# Altium project a20.PrjPcb
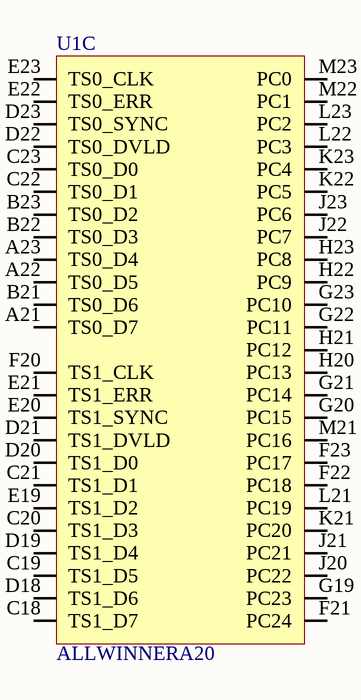
[diagram p0: 01.SchDoc]
8 sheets, 169 parts. Net scope: global (net labels, ports and power ports of the same name join across sheets).
Sheets:
  01.SchDoc
  [02]Power.SchDoc
  [01]DDR3.SchDoc
  [03]SDCard.SchDoc
  [04]USB.SchDoc
  [05]Ethernet.SchDoc
  [06]CPU-PWR.SchDoc
  [07]CPU-Periph.SchDoc

## Sheet 01.SchDoc
size A4

### Parts
U1  MPN: ALLWINNERA20  [A20]  (hidden comment: Allwinner A20 SOC)  (part C of 5)

### Nets

Not connected (* = marked no-connect by the designer): U1 A21(TS0_D7) A22(TS0_D5) A23(TS0_D4) B21(TS0_D6) B22(TS0_D3) B23(TS0_D2) C18(TS1_D7) C19(TS1_D5) C20(TS1_D3) C21(TS1_D1) C22(TS0_D1) C23(TS0_D0) D18(TS1_D6) D19(TS1_D4) D20(TS1_D0) D21(TS1_DVLD) D22(TS0_DVLD) D23(TS0_SYNC) E19(TS1_D2) E20(TS1_SYNC) E21(TS1_ERR) E22(TS0_ERR) E23(TS0_CLK) F20(TS1_CLK) F21(PC24) F22(PC18) F23(PC17) G19(PC23) G20(PC15) G21(PC14) G22(PC11) G23(PC10) H20(PC13) H21(PC12) H22(PC9) H23(PC8) J20(PC22) J21(PC21) J22(PC7) J23(PC6) K21(PC20) K22(PC5) K23(PC4) L21(PC19) L22(PC3) L23(PC2) M21(PC16) M22(PC1) M23(PC0)

### Library data of the parts
U1 = ALLWINNER-A20

## Sheet [02]Power.SchDoc
size A3
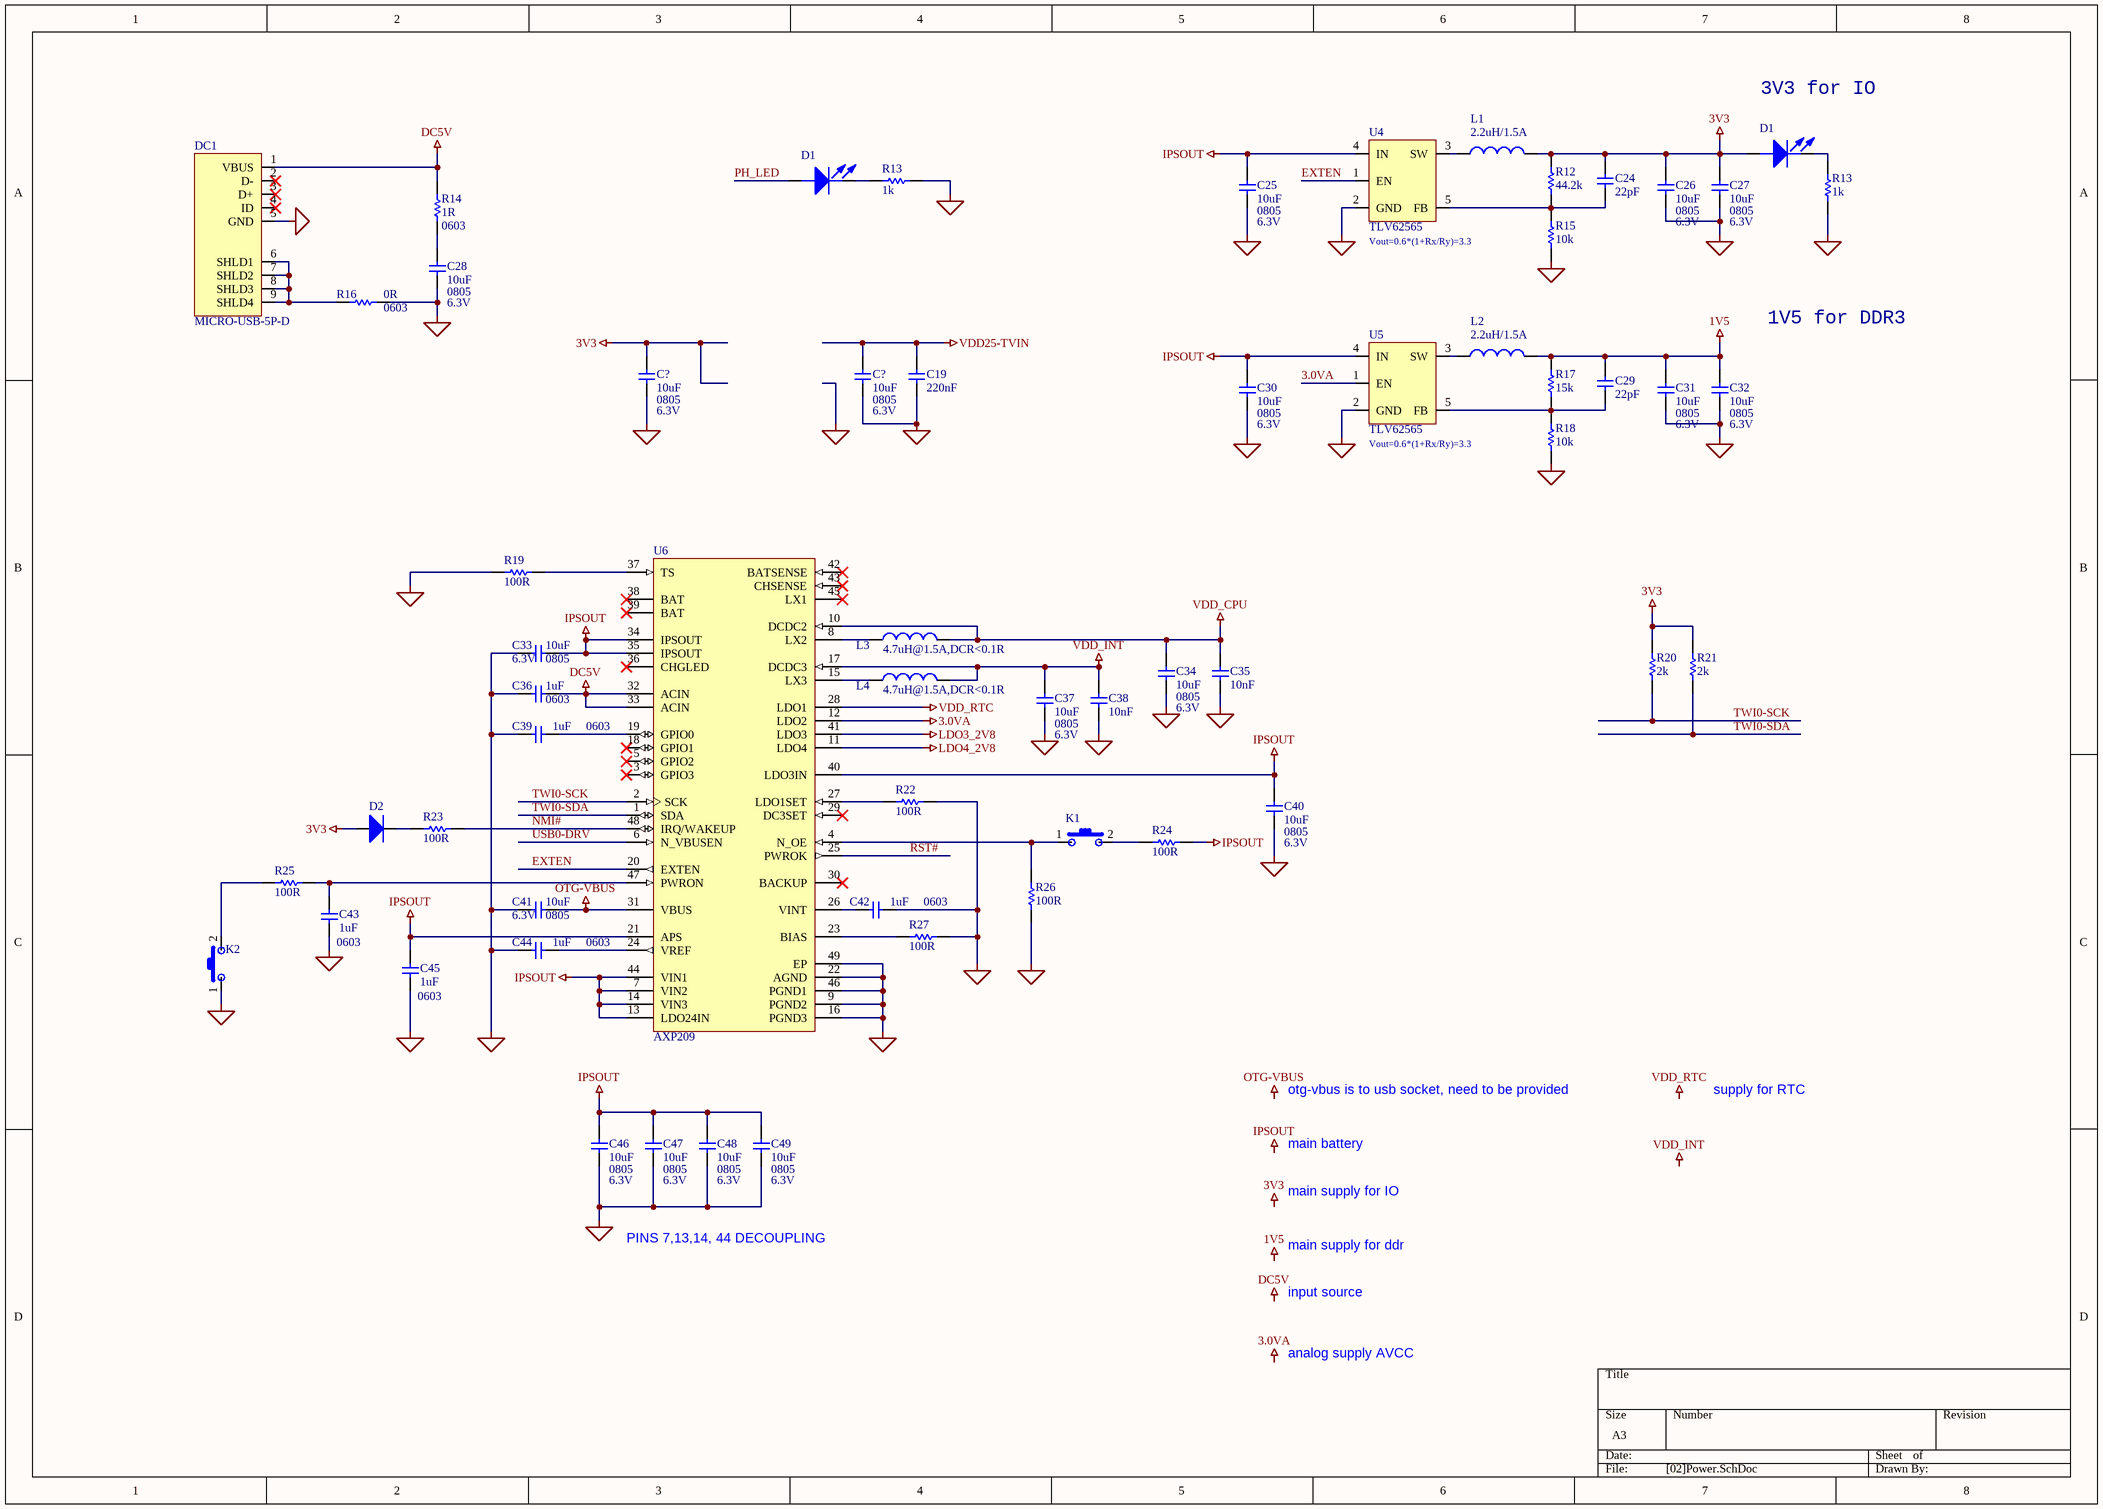
[diagram p1: [02]Power.SchDoc]

### Parts
(Parts that share a designator on the sheet are numbered #1, #2 ... from top to bottom, then left to right.)
C19#1  value 220nF  [C0402]  (hidden comment: SMD Capacitor Chip)
C24  value 22pF  [C0402]  (hidden comment: SMD Capacitor Chip)
C25  value 10uF  Voltage: 6.3V  Package / Case: 0805  [C0805]  (hidden comment: SMD Capacitor Chip)
C26  value 10uF  Voltage: 6.3V  Package / Case: 0805  [C0805]  (hidden comment: SMD Capacitor Chip)
C27  value 10uF  Voltage: 6.3V  Package / Case: 0805  [C0805]  (hidden comment: SMD Capacitor Chip)
C28  value 10uF  Voltage: 6.3V  Package / Case: 0805  [C0805]  (hidden comment: SMD Capacitor Chip)
C29  value 22pF  [C0402]  (hidden comment: SMD Capacitor Chip)
C30  value 10uF  Voltage: 6.3V  Package / Case: 0805  [C0805]  (hidden comment: SMD Capacitor Chip)
C31  value 10uF  Voltage: 6.3V  Package / Case: 0805  [C0805]  (hidden comment: SMD Capacitor Chip)
C32  value 10uF  Voltage: 6.3V  Package / Case: 0805  [C0805]  (hidden comment: SMD Capacitor Chip)
C33  value 10uF  Voltage: 6.3V  Package / Case: 0805  [C0805]  (hidden comment: SMD Capacitor Chip)
C34  value 10uF  Voltage: 6.3V  Package / Case: 0805  [C0805]  (hidden comment: SMD Capacitor Chip)
C35  value 10nF  [C0402]  (hidden comment: SMD Capacitor Chip)
C36  value 1uF  Package / Case: 0603  [C0603]  (hidden comment: SMD Capacitor Chip)
C37  value 10uF  Voltage: 6.3V  Package / Case: 0805  [C0805]  (hidden comment: SMD Capacitor Chip)
C38  value 10nF  [C0402]  (hidden comment: SMD Capacitor Chip)
C39  value 1uF  Package / Case: 0603  [C0603]  (hidden comment: SMD Capacitor Chip)
C40  value 10uF  Voltage: 6.3V  Package / Case: 0805  [C0805]  (hidden comment: SMD Capacitor Chip)
C41  value 10uF  Voltage: 6.3V  Package / Case: 0805  [C0805]  (hidden comment: SMD Capacitor Chip)
C42  value 1uF  Package / Case: 0603  [C0603]  (hidden comment: SMD Capacitor Chip)
C43  value 1uF  Package / Case: 0603  [C0603]  (hidden comment: SMD Capacitor Chip)
C44  value 1uF  Package / Case: 0603  [C0603]  (hidden comment: SMD Capacitor Chip)
C45  value 1uF  Package / Case: 0603  [C0603]  (hidden comment: SMD Capacitor Chip)
C46  value 10uF  Voltage: 6.3V  Package / Case: 0805  [C0805]  (hidden comment: SMD Capacitor Chip)
C47  value 10uF  Voltage: 6.3V  Package / Case: 0805  [C0805]  (hidden comment: SMD Capacitor Chip)
C48  value 10uF  Voltage: 6.3V  Package / Case: 0805  [C0805]  (hidden comment: SMD Capacitor Chip)
C49  value 10uF  Voltage: 6.3V  Package / Case: 0805  [C0805]  (hidden comment: SMD Capacitor Chip)
C?#1  value 10uF  Voltage: 6.3V  Package / Case: 0805  [C0805]  (hidden comment: SMD Capacitor Chip)
C?#2  value 10uF  Voltage: 6.3V  Package / Case: 0805  [C0805]  (hidden comment: SMD Capacitor Chip)
D1#1  SMD Led Diode  (value not drawn)
D1#2  SMD Led Diode  (value not drawn)
D2  Diode SMD Chip  (value not drawn)
DC1  MPN: MICRO-USB-5P-D  (hidden comment: SMD USB Jack)
K1  SMD Tact Switch  (value not drawn)
K2  SMD Tact Switch  (value not drawn)
L1  value 2.2uH/1.5A  (hidden comment: SMD Coil Chip)
L2  value 2.2uH/1.5A  (hidden comment: SMD Coil Chip)
L3  value 4.7uH@1.5A,DCR<0.1R  (hidden comment: SMD Coil Chip)
L4  value 4.7uH@1.5A,DCR<0.1R  (hidden comment: SMD Coil Chip)
R12  value 44.2k  (hidden comment: SMD Resistor Chip)
R13#1  value 1k  (hidden comment: SMD Resistor Chip)
R13#2  value 1k  (hidden comment: SMD Resistor Chip)
R14  value 1R  Package / Case: 0603  (hidden comment: SMD Resistor Chip)
R15  value 10k  (hidden comment: SMD Resistor Chip)
R16  value 0R  Package / Case: 0603  (hidden comment: SMD Resistor Chip)
R17  value 15k  (hidden comment: SMD Resistor Chip)
R18  value 10k  (hidden comment: SMD Resistor Chip)
R19  value 100R  (hidden comment: SMD Resistor Chip)
R20  value 2k  (hidden comment: SMD Resistor Chip)
R21  value 2k  (hidden comment: SMD Resistor Chip)
R22  value 100R  (hidden comment: SMD Resistor Chip)
R23  value 100R  (hidden comment: SMD Resistor Chip)
R24  value 100R  (hidden comment: SMD Resistor Chip)
R25  value 100R  (hidden comment: SMD Resistor Chip)
R26  value 100R  (hidden comment: SMD Resistor Chip)
R27  value 100R  (hidden comment: SMD Resistor Chip)
U4  MPN: TLV62565  (hidden comment: SMD Step-Down Converter)
U5  MPN: TLV62565  (hidden comment: SMD Step-Down Converter)
U6  AXP209  [XPWR-QFN48-4100X4100TP_N]

### Nets
1V5: C29.1 C31.1 C32.1 L2.2 R17.2
3.0VA: U5.1(EN) U6.12(LDO2)
3V3: C24.1 C26.1 C27.1 C?#1.1 D1#1.1 D2.1(A) L1.2 R12.2 R20.2 R21.2
DC5V: C36.1 DC1.1(VBUS) R14.2 U6.32(ACIN) U6.33(ACIN)
IPSOUT: C25.1 C30.1 C33.1 C40.1 C45.2 C46.1 C47.1 C48.1 C49.1 R24.1 U4.4(IN) U5.4(IN) U6.7(VIN2) U6.13(LDO24IN) U6.14(VIN3) U6.21(APS) U6.34(IPSOUT) U6.35(IPSOUT) U6.40(LDO3IN) U6.44(VIN1)
LDO3_2V8: U6.41(LDO3)
LDO4_2V8: U6.11(LDO4)
OTG-VBUS: C41.1 U6.31(VBUS)
SGND: C19#1.1 C25.2 C26.2 C27.2 C28.2 C30.2 C31.2 C32.2 C33.2 C34.2 C35.1 C36.2 C37.2 C38.1 C39.2 C40.2 C41.2 C42.1 C43.1 C44.2 C45.1 C46.2 C47.2 C48.2 C49.2 C?#1.2 C?#2.2 DC1.5(GND) K2.1 R13#1.1 R13#2.1 R15.1 R16.1 R18.1 R19.1 R22.1 R26.1 R27.2 U4.2(GND) U5.2(GND) U6.9(PGND2) U6.16(PGND3) U6.22(AGND) U6.46(PGND1) U6.49(EP)
VDD25-TVIN: C19#1.2 C?#2.1
VDD_CPU: C34.1 C35.2 L3.2 U6.10(DCDC2)
VDD_INT: C37.1 C38.2 L4.2 U6.17(DCDC3)
VDD_RTC: U6.28(LDO1)
EXTEN: U4.1(EN) U6.20(EXTEN)
NMI#: R23.2 U6.48(IRQ/WAKEUP)
PH_LED: D1#2.1
RST#: U6.25(PWROK)
TWI0-SCK: R20.1 U6.2(SCK)
TWI0-SDA: R21.1 U6.1(SDA)
USB0-DRV: U6.6(N_VBUSEN)
NetC24_2: C24.2 R12.1 R15.2 U4.5(FB)
NetC28_1: C28.1 R14.1
NetC29_2: C29.2 R17.1 R18.2 U5.5(FB)
NetC39_1: C39.1 U6.19(GPIO0)
NetC42_2: C42.2 U6.26(VINT)
NetC43_2: C43.2 R25.2 U6.47(PWRON)
NetC44_1: C44.1 U6.24(VREF)
NetD1#1_2: D1#1.2 R13#2.2
NetD1#2_2: D1#2.2 R13#1.2
NetD2_2: D2.2(K) R23.1
NetDC1_6: DC1.6(SHLD1) DC1.7(SHLD2) DC1.8(SHLD3) DC1.9(SHLD4) R16.2
NetK1_1: K1.1 R26.2 U6.4(N_OE)
NetK1_2: K1.2 R24.2
NetK2_2: K2.2 R25.1
NetL1_1: L1.1 U4.3(SW)
NetL2_1: L2.1 U5.3(SW)
NetL3_1: L3.1 U6.8(LX2)
NetL4_1: L4.1 U6.15(LX3)
NetR19_2: R19.2 U6.37(TS)
NetR22_2: R22.2 U6.27(LDO1SET)
NetR27_1: R27.1 U6.23(BIAS)

Not connected (* = marked no-connect by the designer): DC1 2(D-)* 3(D+)* 4(ID)*; U6 3(GPIO3)* 5(GPIO2)* 18(GPIO1)* 29(DC3SET)* 30(BACKUP)* 36(CHGLED)* 38(BAT)* 39(BAT)* 42(BATSENSE)* 43(CHSENSE)* 45(LX1)*

### Notes on the sheet
- 3V3 for IO
- (near U4) Vout=0.6*(1+Rx/Ry)=3.3
- 1V5 for DDR3
- (near U5) Vout=0.6*(1+Rx/Ry)=3.3
- otg-vbus is to usb socket, need to be provided
- supply for RTC
- main battery
- PINS 7,13,14, 44 DECOUPLING
- main supply for IO
- main supply for ddr
- input source
- analog supply AVCC
- Labels drawn without touching a wire or pin: 1V5, 3.0VA, 3V3, DC5V, IPSOUT, OTG-VBUS, VDD_INT, VDD_RTC

### Library data of the parts
C19#1 C24 C29 C35 C38 = CAP: SMD Capacitor; Tolerance: 20%; Voltage: 50V; MPN: ?; Package / Case: 0402
C25-C28 C30-C34 C37 C40 C41 C46-C49 C?#1 C?#2 = CAP: SMD Capacitor; Tolerance: 20%; MPN: ?
C36 C39 C42-C45 = CAP: SMD Capacitor; Tolerance: 20%; Voltage: 16V; MPN: ?
D1#1 D1#2 = LED: SMD Led Diode Chip; MPN: ?; Package / Case: LED0805; Manufacturer: ?
D2 = DIODE: SMD Diode; MPN: ?; Value: ?; Voltage: ?
DC1 = USB-JACK: SMD USB DC Jack
K1 K2 = BUTTON: MPN: ?
L1-L4 = COIL: SMD Coil; Current Rating: 1A; Inductance: 4.7uH; MPN: ?; Series Resistance: ?
R12 R13#1 R13#2 R14-R27 = RES: SMD Resistor; Tolerance: 1%; MPN: ?
  R12 R13#1 R13#2 R15 R17 R18: Package / Case: 0603
  R19-R27: Package / Case: 0402
U4 U5 = TLV6256x: TLV6256x 1.5-A High Efficiency Step-Down Converters in SOT-23 5-Pin Package; Manufacturer: Texas Instruments
U6 = CMP-0571-00001-2: Enhanced Single Cell Li-Battery and Power System Management IC, 2 Channel Buck DC-DC Converter, 5 Channel LDO, 12-Bit ADC, 4 Channel GPIO, -40 to 130 degC, 48-Pin QFN; Manufacturer: X-Powers; Iout: 2500 mA; ACIN Under Voltage Locout: 3.8 V; Oscillator Frequency: 1.5 MHz; Charge Current: 1200 mA; ACIN Input Voltage: 3.8 to 6.3 V; ComponentLink2URL: http://www.x-powers.com/download/AXP209%20Datasheet%20v1.0_cn.pdf; ComponentLink1URL: http://www.x-powers.com/; PackageDescription: 48-Pin Quad Flat No-Lead Package, Body 6 x 6 mm, Pitch 0.4 mm; Operating Temperature Range: -40 to 130 degC; PackageReference: QFN-48; ComponentLink1Description: Manufacturer URL; PartNumber: AXP209; DatasheetVersion: V1.0; Mounting Technology: Surface Mount; ComponentLink2Description: Datasheet

## Sheet [01]DDR3.SchDoc
size A3
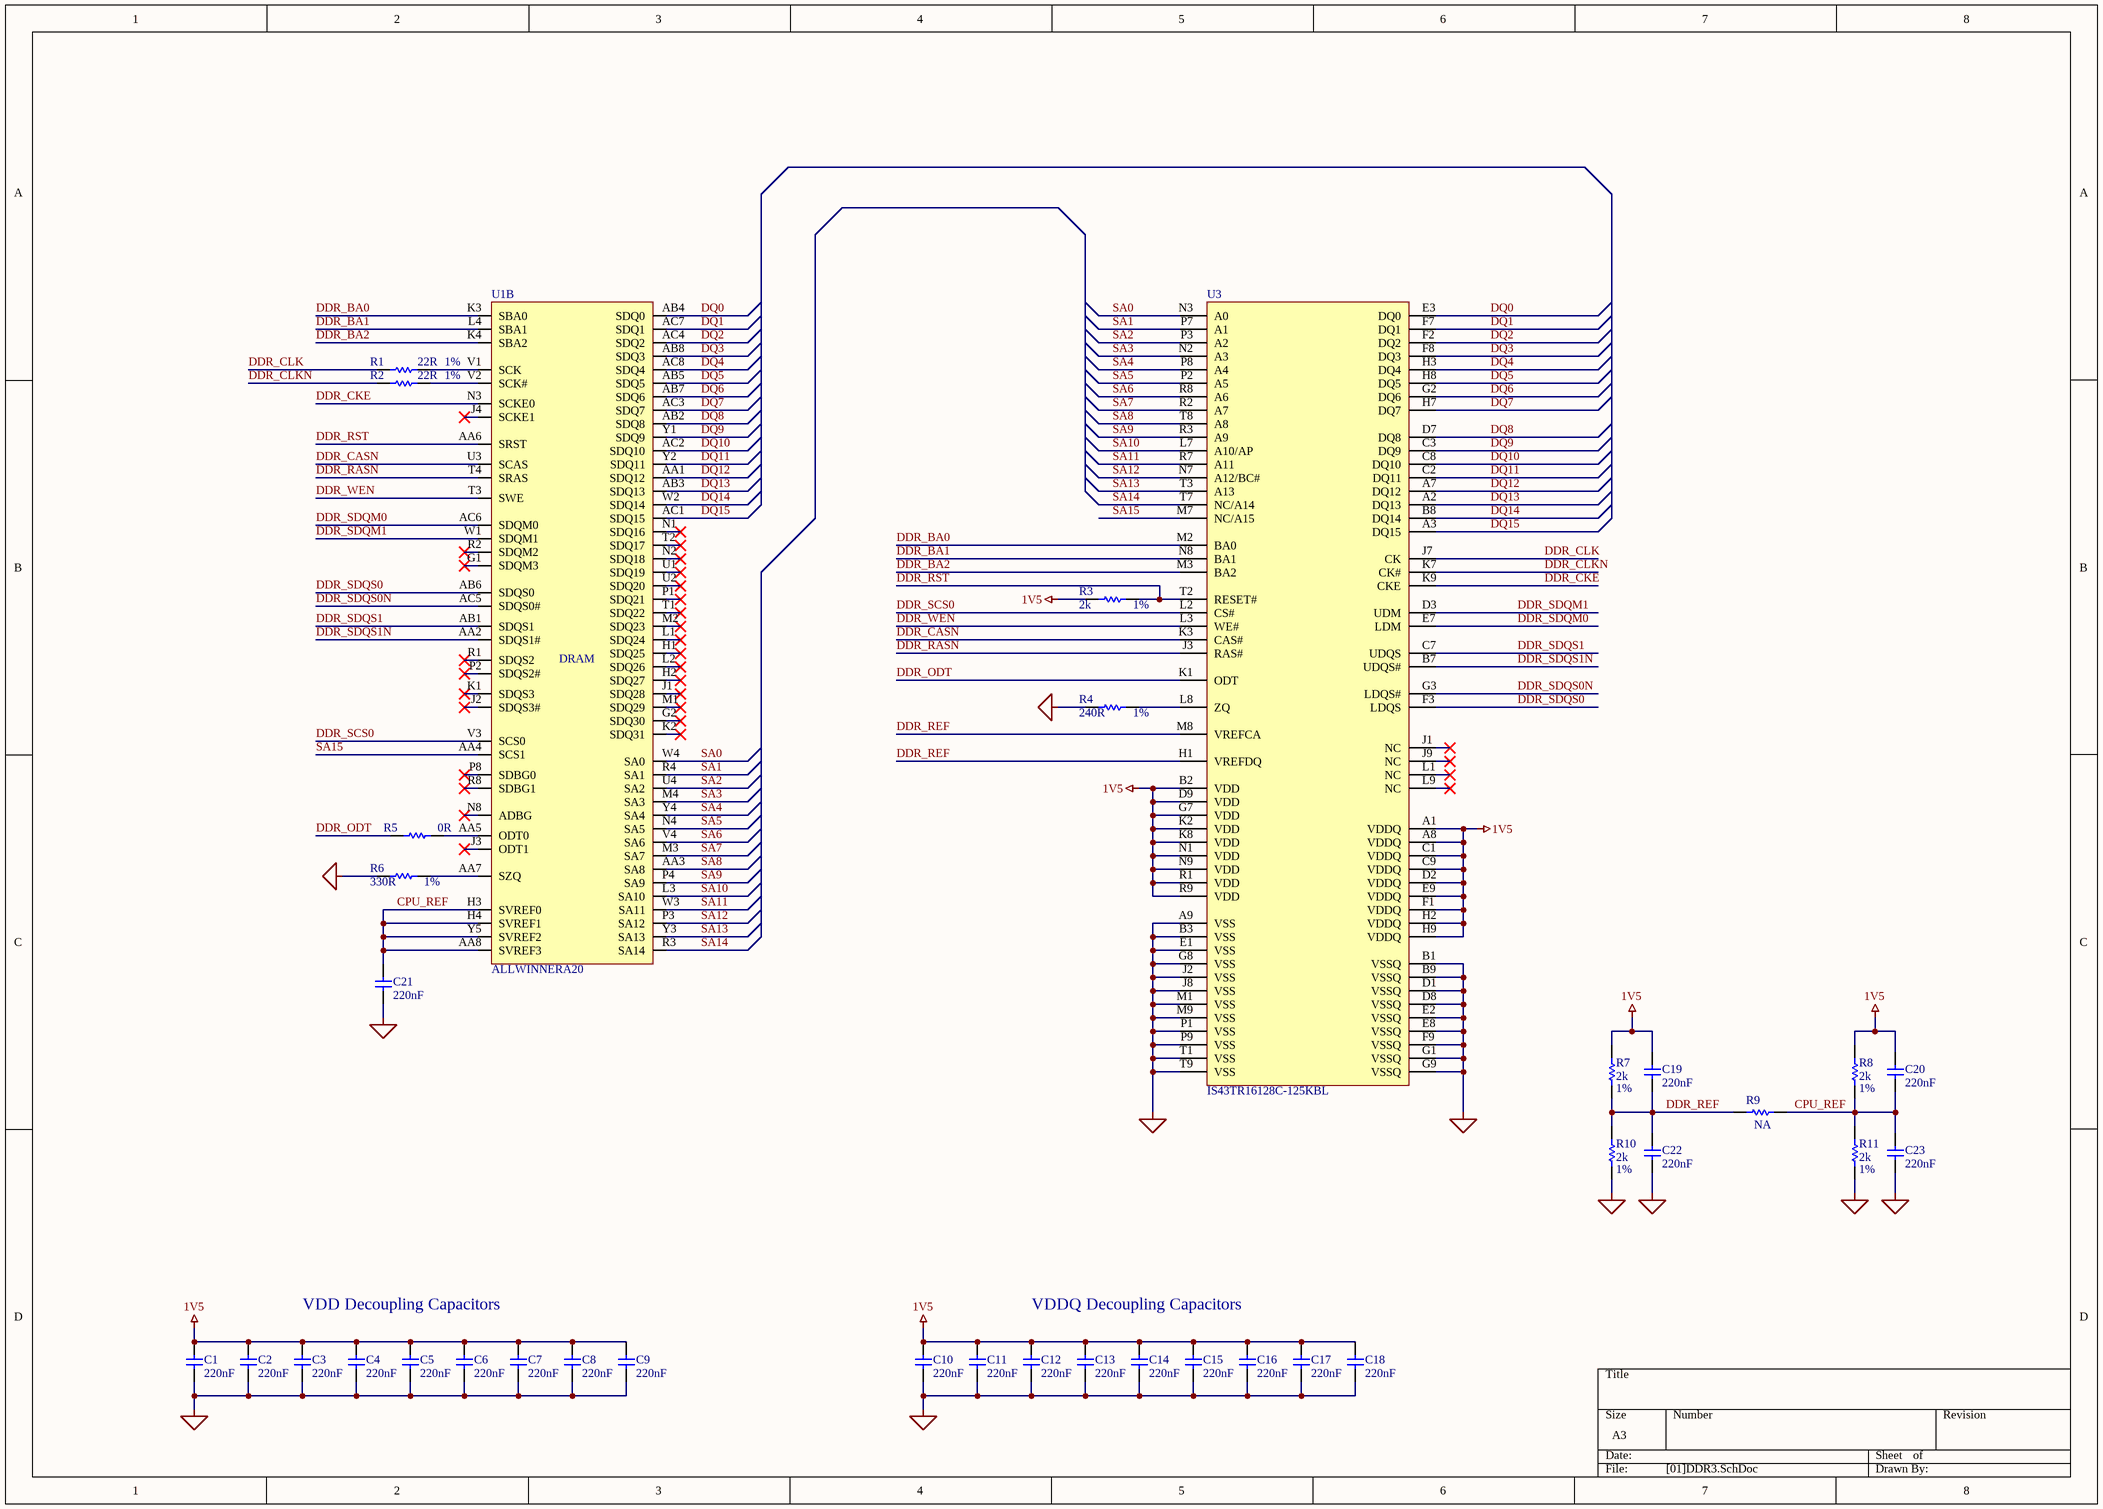
[diagram p2: [01]DDR3.SchDoc]

### Parts
(Parts that share a designator on the sheet are numbered #1, #2 ... from top to bottom, then left to right.)
C1  value 220nF  [C0402]  (hidden comment: SMD Capacitor Chip)
C2  value 220nF  [C0402]  (hidden comment: SMD Capacitor Chip)
C3  value 220nF  [C0402]  (hidden comment: SMD Capacitor Chip)
C4  value 220nF  [C0402]  (hidden comment: SMD Capacitor Chip)
C5  value 220nF  [C0402]  (hidden comment: SMD Capacitor Chip)
C6  value 220nF  [C0402]  (hidden comment: SMD Capacitor Chip)
C7  value 220nF  [C0402]  (hidden comment: SMD Capacitor Chip)
C8  value 220nF  [C0402]  (hidden comment: SMD Capacitor Chip)
C9  value 220nF  [C0402]  (hidden comment: SMD Capacitor Chip)
C10  value 220nF  [C0402]  (hidden comment: SMD Capacitor Chip)
C11  value 220nF  [C0402]  (hidden comment: SMD Capacitor Chip)
C12  value 220nF  [C0402]  (hidden comment: SMD Capacitor Chip)
C13  value 220nF  [C0402]  (hidden comment: SMD Capacitor Chip)
C14  value 220nF  [C0402]  (hidden comment: SMD Capacitor Chip)
C15  value 220nF  [C0402]  (hidden comment: SMD Capacitor Chip)
C16  value 220nF  [C0402]  (hidden comment: SMD Capacitor Chip)
C17  value 220nF  [C0402]  (hidden comment: SMD Capacitor Chip)
C18  value 220nF  [C0402]  (hidden comment: SMD Capacitor Chip)
C19#2  value 220nF  [C0402]  (hidden comment: SMD Capacitor Chip)
C20  value 220nF  [C0402]  (hidden comment: SMD Capacitor Chip)
C21  value 220nF  [C0402]  (hidden comment: SMD Capacitor Chip)
C22  value 220nF  [C0402]  (hidden comment: SMD Capacitor Chip)
C23  value 220nF  [C0402]  (hidden comment: SMD Capacitor Chip)
R1  value 22R  Tolerance: 1%  (hidden comment: SMD Resistor Chip)
R2  value 22R  Tolerance: 1%  (hidden comment: SMD Resistor Chip)
R3  value 2k  Tolerance: 1%  (hidden comment: SMD Resistor Chip)
R4  value 240R  Tolerance: 1%  (hidden comment: SMD Resistor Chip)
R5  value 0R  (hidden comment: SMD Resistor Chip)
R6  value 330R  Tolerance: 1%  (hidden comment: SMD Resistor Chip)
R7  value 2k  Tolerance: 1%  (hidden comment: SMD Resistor Chip)
R8  value 2k  Tolerance: 1%  (hidden comment: SMD Resistor Chip)
R9  value NA  (hidden comment: SMD Resistor Chip)
R10  value 2k  Tolerance: 1%  (hidden comment: SMD Resistor Chip)
R11  value 2k  Tolerance: 1%  (hidden comment: SMD Resistor Chip)
U1  MPN: ALLWINNERA20  [A20]  (hidden comment: Allwinner A20 SOC)  (part B of 5)
U3  MPN: IS43TR16128C-125KBL  [BGA96L]  (hidden comment: DDR3 SDRAM)

### Nets
1V5: C1.2 C2.2 C3.2 C4.2 C5.2 C6.2 C7.2 C8.2 C9.2 C10.2 C11.2 C12.2 C13.2 C14.2 C15.2 C16.2 C17.2 C18.2 C19#2.2 C20.2 R3.1 R7.1 R8.1 U3.A1(VDDQ) U3.A8(VDDQ) U3.B2(VDD) U3.C1(VDDQ) U3.C9(VDDQ) U3.D2(VDDQ) U3.D9(VDD) U3.E9(VDDQ) U3.F1(VDDQ) U3.G7(VDD) U3.H2(VDDQ) U3.H9(VDDQ) U3.K2(VDD) U3.K8(VDD) U3.N1(VDD) U3.N9(VDD) U3.R1(VDD) U3.R9(VDD)
SGND: C1.1 C2.1 C3.1 C4.1 C5.1 C6.1 C7.1 C8.1 C9.1 C10.1 C11.1 C12.1 C13.1 C14.1 C15.1 C16.1 C17.1 C18.1 C21.1 C22.1 C23.1 R4.1 R6.1 R10.2 R11.2 U3.A9(VSS) U3.B1(VSSQ) U3.B3(VSS) U3.B9(VSSQ) U3.D1(VSSQ) U3.D8(VSSQ) U3.E1(VSS) U3.E2(VSSQ) U3.E8(VSSQ) U3.F9(VSSQ) U3.G1(VSSQ) U3.G8(VSS) U3.G9(VSSQ) U3.J2(VSS) U3.J8(VSS) U3.M1(VSS) U3.M9(VSS) U3.P1(VSS) U3.P9(VSS) U3.T1(VSS) U3.T9(VSS)
CPU_REF: C20.1 C21.2 C23.2 R8.2 R9.2 R11.1 U1.AA8(SVREF3) U1.H3(SVREF0) U1.H4(SVREF1) U1.Y5(SVREF2)
DDR_BA0: U1.K3(SBA0) U3.M2(BA0)
DDR_BA1: U1.L4(SBA1) U3.N8(BA1)
DDR_BA2: U1.K4(SBA2) U3.M3(BA2)
DDR_CASN: U1.U3(SCAS) U3.K3(CAS#)
DDR_CKE: U1.N3(SCKE0) U3.K9(CKE)
DDR_CLK: R1.1 U3.J7(CK)
DDR_CLKN: R2.1 U3.K7(CK#)
DDR_ODT: R5.1 U3.K1(ODT)
DDR_RASN: U1.T4(SRAS) U3.J3(RAS#)
DDR_REF: C19#2.1 C22.2 R7.2 R9.1 R10.1 U3.H1(VREFDQ) U3.M8(VREFCA)
DDR_RST: R3.2 U1.AA6(SRST) U3.T2(RESET#)
DDR_SCS0: U1.V3(SCS0) U3.L2(CS#)
DDR_SDQM0: U1.AC6(SDQM0) U3.E7(LDM)
DDR_SDQM1: U1.W1(SDQM1) U3.D3(UDM)
DDR_SDQS0: U1.AB6(SDQS0) U3.F3(LDQS)
DDR_SDQS0N: U1.AC5(SDQS0#) U3.G3(LDQS#)
DDR_SDQS1: U1.AB1(SDQS1) U3.C7(UDQS)
DDR_SDQS1N: U1.AA2(SDQS1#) U3.B7(UDQS#)
DDR_WEN: U1.T3(SWE) U3.L3(WE#)
DQ0: U1.AB4(SDQ0) U3.E3(DQ0)
DQ1: U1.AC7(SDQ1) U3.F7(DQ1)
DQ2: U1.AC4(SDQ2) U3.F2(DQ2)
DQ3: U1.AB8(SDQ3) U3.F8(DQ3)
DQ4: U1.AC8(SDQ4) U3.H3(DQ4)
DQ5: U1.AB5(SDQ5) U3.H8(DQ5)
DQ6: U1.AB7(SDQ6) U3.G2(DQ6)
DQ7: U1.AC3(SDQ7) U3.H7(DQ7)
DQ8: U1.AB2(SDQ8) U3.D7(DQ8)
DQ9: U1.Y1(SDQ9) U3.C3(DQ9)
DQ10: U1.AC2(SDQ10) U3.C8(DQ10)
DQ11: U1.Y2(SDQ11) U3.C2(DQ11)
DQ12: U1.AA1(SDQ12) U3.A7(DQ12)
DQ13: U1.AB3(SDQ13) U3.A2(DQ13)
DQ14: U1.W2(SDQ14) U3.B8(DQ14)
DQ15: U1.AC1(SDQ15) U3.A3(DQ15)
SA0: U1.W4(SA0) U3.N3(A0)
SA1: U1.R4(SA1) U3.P7(A1)
SA2: U1.U4(SA2) U3.P3(A2)
SA3: U1.M4(SA3) U3.N2(A3)
SA4: U1.Y4(SA4) U3.P8(A4)
SA5: U1.N4(SA5) U3.P2(A5)
SA6: U1.V4(SA6) U3.R8(A6)
SA7: U1.M3(SA7) U3.R2(A7)
SA8: U1.AA3(SA8) U3.T8(A8)
SA9: U1.P4(SA9) U3.R3(A9)
SA10: U1.L3(SA10) U3.L7(A10/AP)
SA11: U1.W3(SA11) U3.R7(A11)
SA12: U1.P3(SA12) U3.N7(A12/BC#)
SA13: U1.Y3(SA13) U3.T3(A13)
SA14: U1.R3(SA14) U3.T7(NC/A14)
SA15: U1.AA4(SCS1) U3.M7(NC/A15)
NetR1_2: R1.2 U1.V1(SCK)
NetR2_2: R2.2 U1.V2(SCK#)
NetR4_2: R4.2 U3.L8(ZQ)
NetR5_2: R5.2 U1.AA5(ODT0)
NetR6_2: R6.2 U1.AA7(SZQ)

Not connected (* = marked no-connect by the designer): U1 G1(SDQM3)* G2(SDQ30)* H1(SDQ25)* H2(SDQ27)* J1(SDQ28)* J2(SDQS3#)* J3(ODT1)* J4(SCKE1)* K1(SDQS3)* K2(SDQ31)* L1(SDQ24)* L2(SDQ26)* M1(SDQ29)* M2(SDQ23)* N1(SDQ16)* N2(SDQ18)* N8(ADBG)* P1(SDQ21)* P2(SDQS2#)* P8(SDBG0)* R1(SDQS2)* R2(SDQM2)* R8(SDBG1)* T1(SDQ22)* T2(SDQ17)* U1(SDQ19)* U2(SDQ20)*; U3 J1(NC)* J9(NC)* L1(NC)* L9(NC)*

### Notes on the sheet
- VDD Decoupling Capacitors
- VDDQ Decoupling Capacitors
- (in symbol ALLWINNER-A20, part B) DRAM

### Library data of the parts
C1-C18 C19#2 C20-C23 = CAP: as C19#1 on sheet [02]Power; MPN: ?; Package / Case: 0402
R1-R4 R6-R8 R10 R11 = RES: SMD Resistor; Package / Case: 0402; MPN: ?
R5 R9 = RES: SMD Resistor; Tolerance: 1%; Package / Case: 0402; MPN: ?
U1 = ALLWINNER-A20
U3 = DDR3-SDRAM: DDR3 SDRAM 96-ball FBGA; Manufacturer: ISSI

## Sheet [03]SDCard.SchDoc
size A4
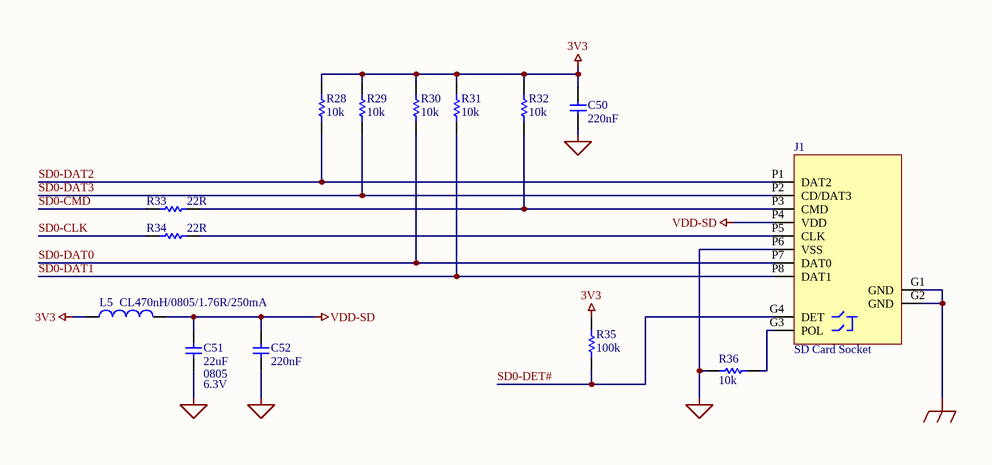
[diagram p3: [03]SDCard.SchDoc]

### Parts
C50  value 220nF  [C0402]  (hidden comment: SMD Capacitor Chip)
C51  value 22uF  Voltage: 6.3V  Package / Case: 0805  [C0805]  (hidden comment: SMD Capacitor Chip)
C52  value 220nF  [C0402]  (hidden comment: SMD Capacitor Chip)
J1  SD Card Socket
L5  value CL470nH/0805/1.76R/250mA  (hidden comment: SMD Coil Chip)
R28  value 10k  (hidden comment: SMD Resistor Chip)
R29  value 10k  (hidden comment: SMD Resistor Chip)
R30  value 10k  (hidden comment: SMD Resistor Chip)
R31  value 10k  (hidden comment: SMD Resistor Chip)
R32  value 10k  (hidden comment: SMD Resistor Chip)
R33  value 22R  (hidden comment: SMD Resistor Chip)
R34  value 22R  (hidden comment: SMD Resistor Chip)
R35  value 100k  (hidden comment: SMD Resistor Chip)
R36  value 10k  (hidden comment: SMD Resistor Chip)

### Nets
3V3: C50.2 L5.1 R28.1 R29.1 R30.1 R31.1 R32.1 R35.1
SGND: C50.1 C51.2 C52.1 J1.G1(GND) J1.G2(GND) J1.P6(VSS) R36.1
VDD-SD: C51.1 C52.2 J1.P4(VDD) L5.2
SD0-CLK: R34.1
SD0-CMD: R33.1
SD0-DAT0: J1.P7(DAT0) R30.2
SD0-DAT1: J1.P8(DAT1) R31.2
SD0-DAT2: J1.P1(DAT2) R28.2
SD0-DAT3: J1.P2(CD/DAT3) R29.2
SD0-DET#: J1.G4(DET) R35.2
NetJ1_G3: J1.G3(POL) R36.2
NetJ1_P3: J1.P3(CMD) R32.2 R33.2
NetJ1_P5: J1.P5(CLK) R34.2

### Library data of the parts
C50 C52 = CAP: as C19#1 on sheet [02]Power; MPN: ?; Package / Case: 0402
C51 = CAP: SMD Capacitor; Tolerance: 20%; MPN: ?
J1 = SD/MMC: SMD SD Card Socket; MPN: 502570-0893; Manufacturer: Molex
L5 = COIL: as L1 on sheet [02]Power; MPN: ?; Series Resistance: ?
R28-R36 = RES: SMD Resistor; Tolerance: 1%; Package / Case: 0402; MPN: ?

## Sheet [04]USB.SchDoc
size A4
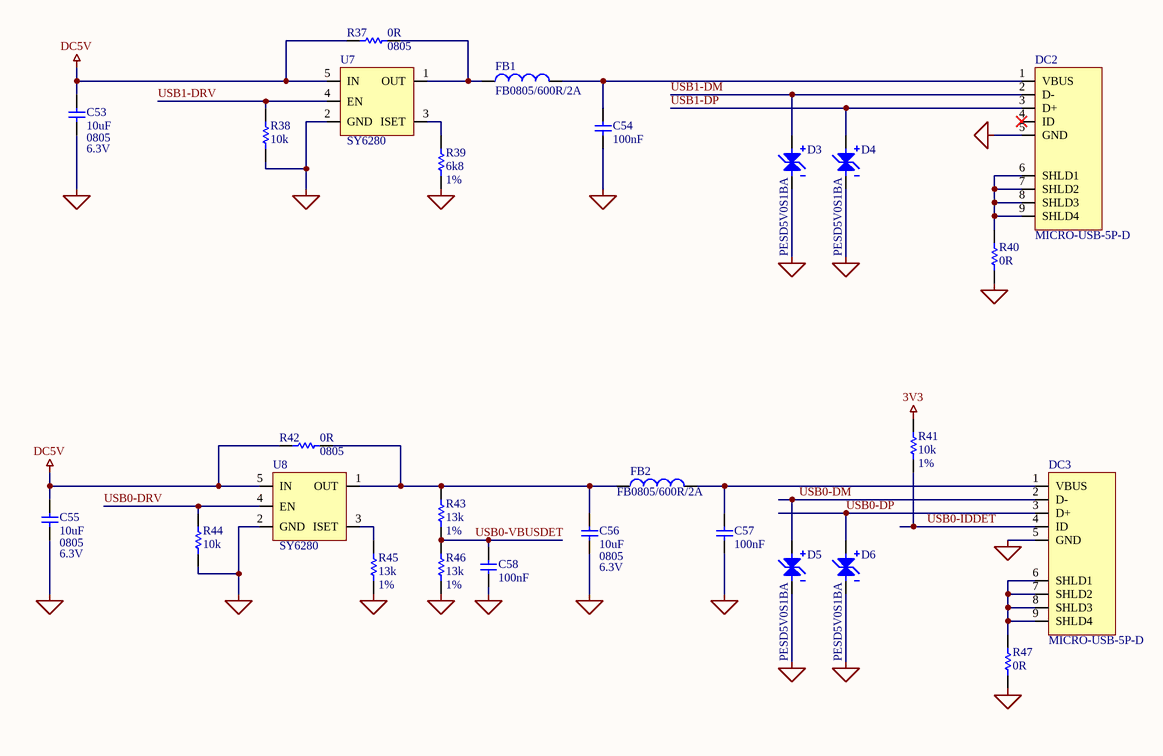
[diagram p4: [04]USB.SchDoc]

### Parts
C53  value 10uF  Voltage: 6.3V  Package / Case: 0805  [C0805]  (hidden comment: SMD Capacitor Chip)
C54  value 100nF  [C0402]  (hidden comment: SMD Capacitor Chip)
C55  value 10uF  Voltage: 6.3V  Package / Case: 0805  [C0805]  (hidden comment: SMD Capacitor Chip)
C56  value 10uF  Voltage: 6.3V  Package / Case: 0805  [C0805]  (hidden comment: SMD Capacitor Chip)
C57  value 100nF  [C0402]  (hidden comment: SMD Capacitor Chip)
C58  value 100nF  [C0402]  (hidden comment: SMD Capacitor Chip)
D3  MPN: PESD5V0S1BA  (hidden comment: SMD ESD Diode)
D4  MPN: PESD5V0S1BA  (hidden comment: SMD ESD Diode)
D5  MPN: PESD5V0S1BA  (hidden comment: SMD ESD Diode)
D6  MPN: PESD5V0S1BA  (hidden comment: SMD ESD Diode)
DC2  MPN: MICRO-USB-5P-D  (hidden comment: SMD USB Jack)
DC3  MPN: MICRO-USB-5P-D  (hidden comment: SMD USB Jack)
FB1  value FB0805/600R/2A  (hidden comment: SMD Coil Chip)
FB2  value FB0805/600R/2A  (hidden comment: SMD Coil Chip)
R37  value 0R  Package / Case: 0805  (hidden comment: SMD Resistor Chip)
R38  value 10k  (hidden comment: SMD Resistor Chip)
R39  value 6k8  Tolerance: 1%  (hidden comment: SMD Resistor Chip)
R40  value 0R  (hidden comment: SMD Resistor Chip)
R41  value 10k  Tolerance: 1%  (hidden comment: SMD Resistor Chip)
R42  value 0R  Package / Case: 0805  (hidden comment: SMD Resistor Chip)
R43  value 13k  Tolerance: 1%  (hidden comment: SMD Resistor Chip)
R44  value 10k  (hidden comment: SMD Resistor Chip)
R45  value 13k  Tolerance: 1%  (hidden comment: SMD Resistor Chip)
R46  value 13k  Tolerance: 1%  (hidden comment: SMD Resistor Chip)
R47  value 0R  (hidden comment: SMD Resistor Chip)
U7  SMD Power Distribution Switch  (value not drawn)
U8  SMD Power Distribution Switch  (value not drawn)

### Nets
3V3: R41.1
DC5V: C53.1 C55.1 R37.1 R42.1 U7.5(IN) U8.5(IN)
SGND: C53.2 C54.1 C55.2 C56.2 C57.1 C58.1 D3.2 D4.2 D5.2 D6.2 DC2.5(GND) DC3.5(GND) R38.2 R39.2 R40.2 R44.2 R45.2 R46.2 R47.2 U7.2(GND) U8.2(GND)
USB0-DM: D5.1 DC3.2(D-)
USB0-DP: D6.1 DC3.3(D+)
USB0-DRV: R44.1 U8.4(EN)
USB0-IDDET: DC3.4(ID) R41.2
USB0-VBUSDET: C58.2 R43.2 R46.1
USB1-DM: D3.1 DC2.2(D-)
USB1-DP: D4.1 DC2.3(D+)
USB1-DRV: R38.1 U7.4(EN)
NetC54_2: C54.2 DC2.1(VBUS) FB1.2
NetC56_1: C56.1 FB2.1 R42.2 R43.1 U8.1(OUT)
NetC57_2: C57.2 DC3.1(VBUS) FB2.2
NetDC2_6: DC2.6(SHLD1) DC2.7(SHLD2) DC2.8(SHLD3) DC2.9(SHLD4) R40.1
NetDC3_6: DC3.6(SHLD1) DC3.7(SHLD2) DC3.8(SHLD3) DC3.9(SHLD4) R47.1
NetFB1_1: FB1.1 R37.2 U7.1(OUT)
NetR39_1: R39.1 U7.3(ISET)
NetR45_1: R45.1 U8.3(ISET)

Not connected (* = marked no-connect by the designer): DC2 4(ID)*

### Library data of the parts
C53 C55 C56 = CAP: SMD Capacitor; Tolerance: 20%; MPN: ?
C54 C57 C58 = CAP: as C19#1 on sheet [02]Power; MPN: ?; Package / Case: 0402
D3-D6 = DIODE ESD: SMD ESD Diode Chip; Manufacturer: ?
DC2 DC3 = USB-JACK: SMD USB DC Jack
FB1 FB2 = COIL: as L1 on sheet [02]Power; MPN: ?; Series Resistance: ?
R37 R38 R40 R42 R44 R47 = RES: SMD Resistor; Tolerance: 1%; MPN: ?
  R38 R40 R44 R47: Package / Case: 0603
R39 R41 R43 R45 R46 = RES: SMD Resistor; Package / Case: 0603; MPN: ?
U7 U8 = SY6280: Low Loss Power Distribution Switch; Manufacturer: SILERGY; MPN: SY6280

## Sheet [05]Ethernet.SchDoc
size A4
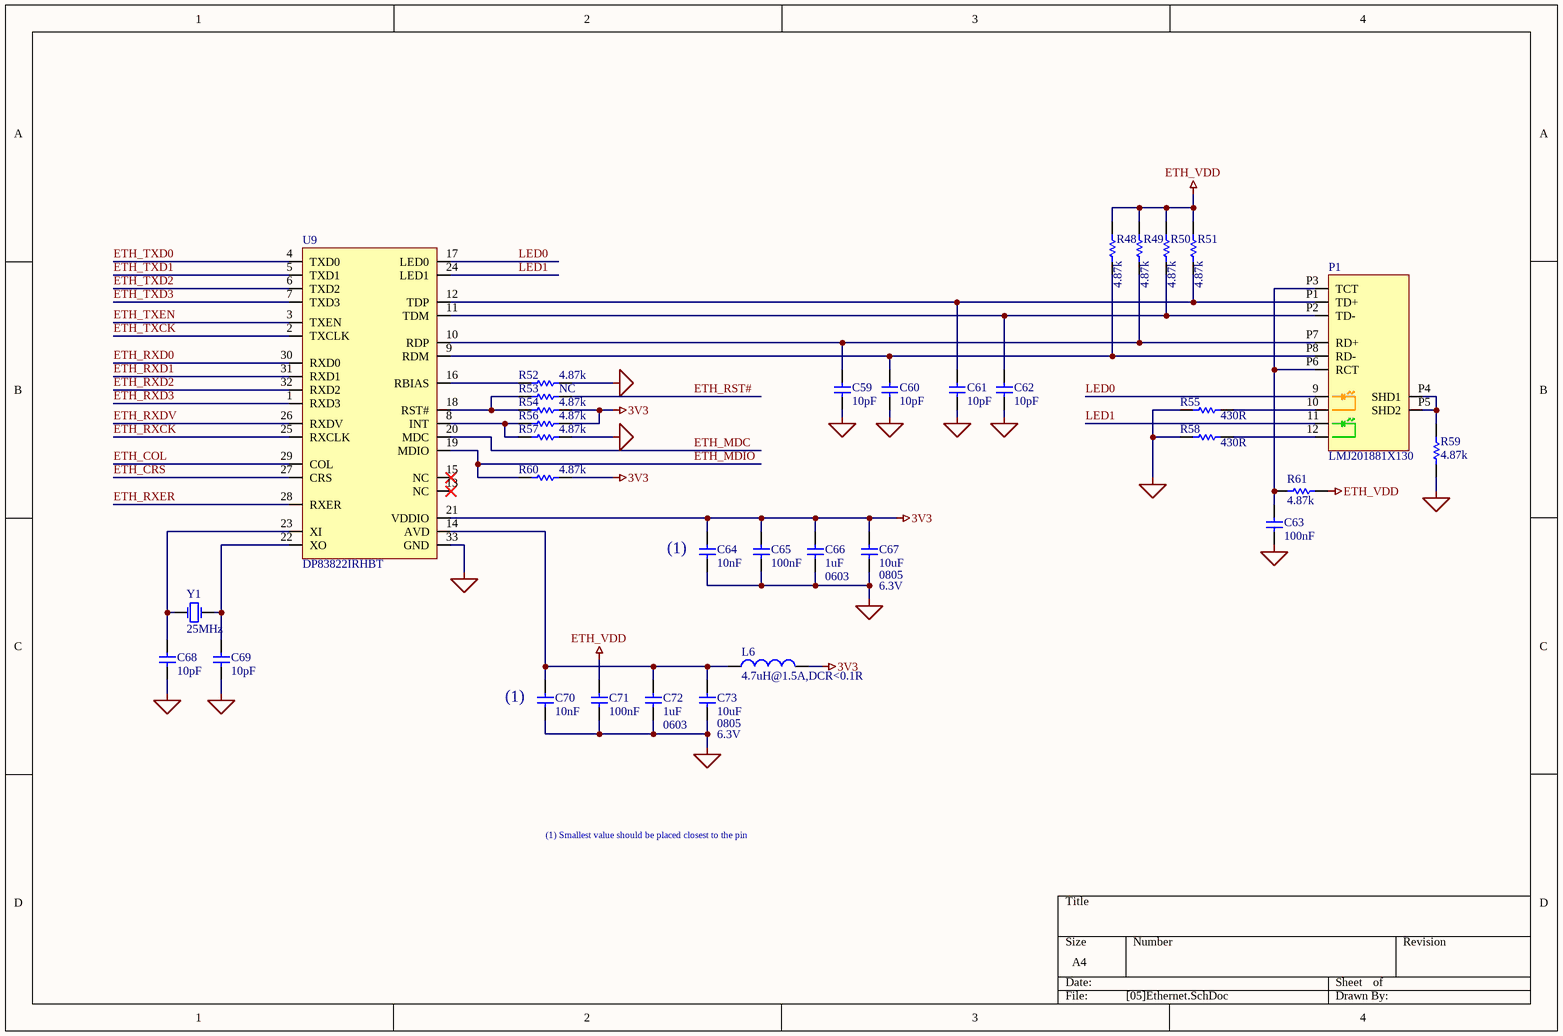
[diagram p5: [05]Ethernet.SchDoc]

### Parts
C59  value 10pF  [C0402]  (hidden comment: SMD Capacitor Chip)
C60  value 10pF  [C0402]  (hidden comment: SMD Capacitor Chip)
C61  value 10pF  [C0402]  (hidden comment: SMD Capacitor Chip)
C62  value 10pF  [C0402]  (hidden comment: SMD Capacitor Chip)
C63  value 100nF  [C0402]  (hidden comment: SMD Capacitor Chip)
C64  value 10nF  [C0402]  (hidden comment: SMD Capacitor Chip)
C65  value 100nF  [C0402]  (hidden comment: SMD Capacitor Chip)
C66  value 1uF  Package / Case: 0603  [C0603]  (hidden comment: SMD Capacitor Chip)
C67  value 10uF  Voltage: 6.3V  Package / Case: 0805  [C0805]  (hidden comment: SMD Capacitor Chip)
C68  value 10pF  [C0402]  (hidden comment: SMD Capacitor Chip)
C69  value 10pF  [C0402]  (hidden comment: SMD Capacitor Chip)
C70  value 10nF  [C0402]  (hidden comment: SMD Capacitor Chip)
C71  value 100nF  [C0402]  (hidden comment: SMD Capacitor Chip)
C72  value 1uF  Package / Case: 0603  [C0603]  (hidden comment: SMD Capacitor Chip)
C73  value 10uF  Voltage: 6.3V  Package / Case: 0805  [C0805]  (hidden comment: SMD Capacitor Chip)
L6  value 4.7uH@1.5A,DCR<0.1R  (hidden comment: SMD Coil Chip)
P1  MPN: LMJ201881X130  (hidden comment: RJ45 Connector)
R48  value 4.87k  (hidden comment: SMD Resistor Chip)
R49  value 4.87k  (hidden comment: SMD Resistor Chip)
R50  value 4.87k  (hidden comment: SMD Resistor Chip)
R51  value 4.87k  (hidden comment: SMD Resistor Chip)
R52  value 4.87k  (hidden comment: SMD Resistor Chip)
R53  value NC  (hidden comment: SMD Resistor Chip)
R54  value 4.87k  (hidden comment: SMD Resistor Chip)
R55  value 430R  (hidden comment: SMD Resistor Chip)
R56  value 4.87k  (hidden comment: SMD Resistor Chip)
R57  value 4.87k  (hidden comment: SMD Resistor Chip)
R58  value 430R  (hidden comment: SMD Resistor Chip)
R59  value 4.87k  (hidden comment: SMD Resistor Chip)
R60  value 4.87k  (hidden comment: SMD Resistor Chip)
R61  value 4.87k  (hidden comment: SMD Resistor Chip)
U9  MPN: DP83822IRHBT  (hidden comment: SMD Ethernet PHY)
Y1  Frequency: 25MHz  (hidden comment: XTAL)

### Nets
3V3: C64.2 C65.2 C66.1 C67.1 L6.2 R54.2 R56.2 R60.2 U9.21(VDDIO)
ETH_VDD: C71.2 R48.2 R49.2 R50.2 R51.2 R61.1
SGND: C59.1 C60.1 C61.1 C62.1 C63.1 C64.1 C65.1 C66.2 C67.2 C68.2 C69.2 C70.1 C71.1 C72.2 C73.2 R52.2 R55.2 R57.2 R58.2 R59.2 U9.33(GND)
ETH_COL: U9.29(COL)
ETH_CRS: U9.27(CRS)
ETH_MDC: U9.20(MDC)
ETH_MDIO: R60.1 U9.19(MDIO)
ETH_RST#: R53.2
ETH_RXCK: U9.25(RXCLK)
ETH_RXD0: U9.30(RXD0)
ETH_RXD1: U9.31(RXD1)
ETH_RXD2: U9.32(RXD2)
ETH_RXD3: U9.1(RXD3)
ETH_RXDV: U9.26(RXDV)
ETH_RXER: U9.28(RXER)
ETH_TXCK: U9.2(TXCLK)
ETH_TXD0: U9.4(TXD0)
ETH_TXD1: U9.5(TXD1)
ETH_TXD2: U9.6(TXD2)
ETH_TXD3: U9.7(TXD3)
ETH_TXEN: U9.3(TXEN)
LED0: P1.9 U9.17(LED0)
LED1: P1.11 U9.24(LED1)
NetC59_2: C59.2 P1.P7(RD+) R49.1 U9.10(RDP)
NetC60_2: C60.2 P1.P8(RD-) R48.1 U9.9(RDM)
NetC61_2: C61.2 P1.P1(TD+) R51.1 U9.12(TDP)
NetC62_2: C62.2 P1.P2(TD-) R50.1 U9.11(TDM)
NetC63_2: C63.2 P1.P3(TCT) P1.P6(RCT) R61.2
NetC68_1: C68.1 U9.23(XI) Y1.2(OSC2)
NetC69_1: C69.1 U9.22(XO) Y1.1(OSC1)
NetC70_2: C70.2 C72.1 C73.1 L6.1 U9.14(AVD)
NetP1_10: P1.10 R55.1
NetP1_12: P1.12 R58.1
NetP1_P4: P1.P4(SHD1) P1.P5(SHD2) R59.1
NetR52_1: R52.1 U9.16(RBIAS)
NetR53_1: R53.1 R54.1 U9.18(RST#)
NetR56_1: R56.1 R57.1 U9.8(INT)

Not connected (* = marked no-connect by the designer): U9 13(NC)* 15(NC)*

### Notes on the sheet
- (near C64) (1)
- (near C70) (1)
- (1) Smallest value should be placed closest to the pin

### Library data of the parts
C59-C65 C68-C71 = CAP: as C19#1 on sheet [02]Power; MPN: ?; Package / Case: 0402
C66 C72 = CAP: as C36 on sheet [02]Power; MPN: ?
C67 C73 = CAP: SMD Capacitor; Tolerance: 20%; MPN: ?
L6 = COIL: as L1 on sheet [02]Power; MPN: ?; Series Resistance: ?
P1 = RJ45: RJ45 Connector with Magnetics
R48-R61 = RES: SMD Resistor; Tolerance: 1%; Package / Case: 0402; MPN: ?
U9 = DP83822: DP83822 Robust, Low Power 10/100 Mbps Ethernet Physical Layer Transceiver; Manufacturer: Texas Instruments
Y1 = XTAL: SMD Crystal Oscillator; MPN: ?

## Sheet [06]CPU-PWR.SchDoc
size A4
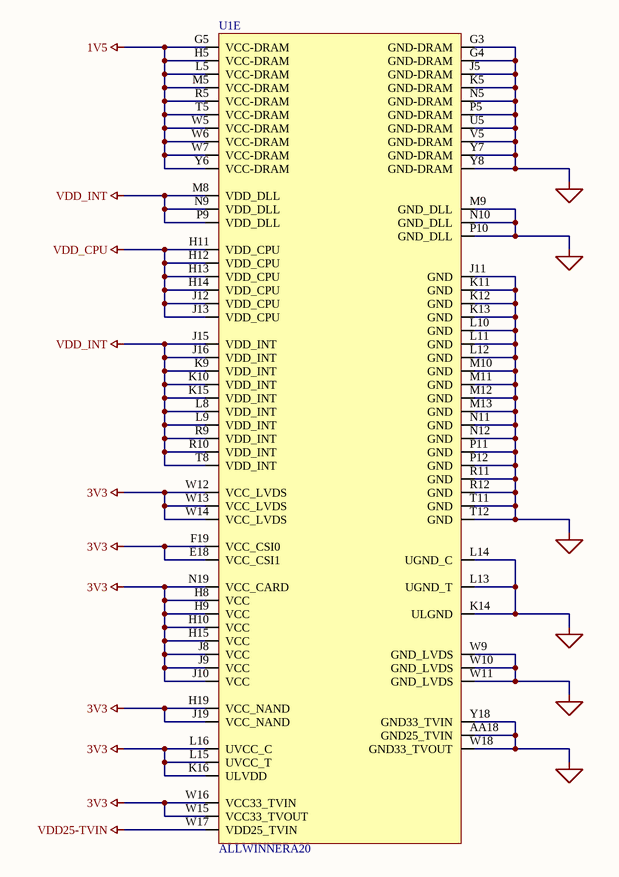
[diagram p6: [06]CPU-PWR.SchDoc]

### Parts
U1  MPN: ALLWINNERA20  [A20]  (hidden comment: Allwinner A20 SOC)  (part E of 5)

### Nets
1V5: U1.G5(VCC-DRAM) U1.H5(VCC-DRAM) U1.L5(VCC-DRAM) U1.M5(VCC-DRAM) U1.R5(VCC-DRAM) U1.T5(VCC-DRAM) U1.W5(VCC-DRAM) U1.W6(VCC-DRAM) U1.W7(VCC-DRAM) U1.Y6(VCC-DRAM)
3V3: U1.E18(VCC_CSI1) U1.F19(VCC_CSI0) U1.H8(VCC) U1.H9(VCC) U1.H10(VCC) U1.H15(VCC) U1.H19(VCC_NAND) U1.J8(VCC) U1.J9(VCC) U1.J10(VCC) U1.J19(VCC_NAND) U1.K16(ULVDD) U1.L15(UVCC_T) U1.L16(UVCC_C) U1.N19(VCC_CARD) U1.W12(VCC_LVDS) U1.W13(VCC_LVDS) U1.W14(VCC_LVDS) U1.W15(VCC33_TVOUT) U1.W16(VCC33_TVIN)
SGND: U1.AA18(GND25_TVIN) U1.G3(GND-DRAM) U1.G4(GND-DRAM) U1.J5(GND-DRAM) U1.J11(GND) U1.K5(GND-DRAM) U1.K11(GND) U1.K12(GND) U1.K13(GND) U1.K14(ULGND) U1.L10(GND) U1.L11(GND) U1.L12(GND) U1.L13(UGND_T) U1.L14(UGND_C) U1.M9(GND_DLL) U1.M10(GND) U1.M11(GND) U1.M12(GND) U1.M13(GND) U1.N5(GND-DRAM) U1.N10(GND_DLL) U1.N11(GND) U1.N12(GND) U1.P5(GND-DRAM) U1.P10(GND_DLL) U1.P11(GND) U1.P12(GND) U1.R11(GND) U1.R12(GND) U1.T11(GND) U1.T12(GND) U1.U5(GND-DRAM) U1.V5(GND-DRAM) U1.W9(GND_LVDS) U1.W10(GND_LVDS) U1.W11(GND_LVDS) U1.W18(GND33_TVOUT) U1.Y7(GND-DRAM) U1.Y8(GND-DRAM) U1.Y18(GND33_TVIN)
VDD25-TVIN: U1.W17(VDD25_TVIN)
VDD_CPU: U1.H11(VDD_CPU) U1.H12(VDD_CPU) U1.H13(VDD_CPU) U1.H14(VDD_CPU) U1.J12(VDD_CPU) U1.J13(VDD_CPU)
VDD_INT: U1.J15(VDD_INT) U1.J16(VDD_INT) U1.K9(VDD_INT) U1.K10(VDD_INT) U1.K15(VDD_INT) U1.L8(VDD_INT) U1.L9(VDD_INT) U1.M8(VDD_DLL) U1.N9(VDD_DLL) U1.P9(VDD_DLL) U1.R9(VDD_INT) U1.R10(VDD_INT) U1.T8(VDD_INT)

### Library data of the parts
U1 = ALLWINNER-A20

## Sheet [07]CPU-Periph.SchDoc
size A3
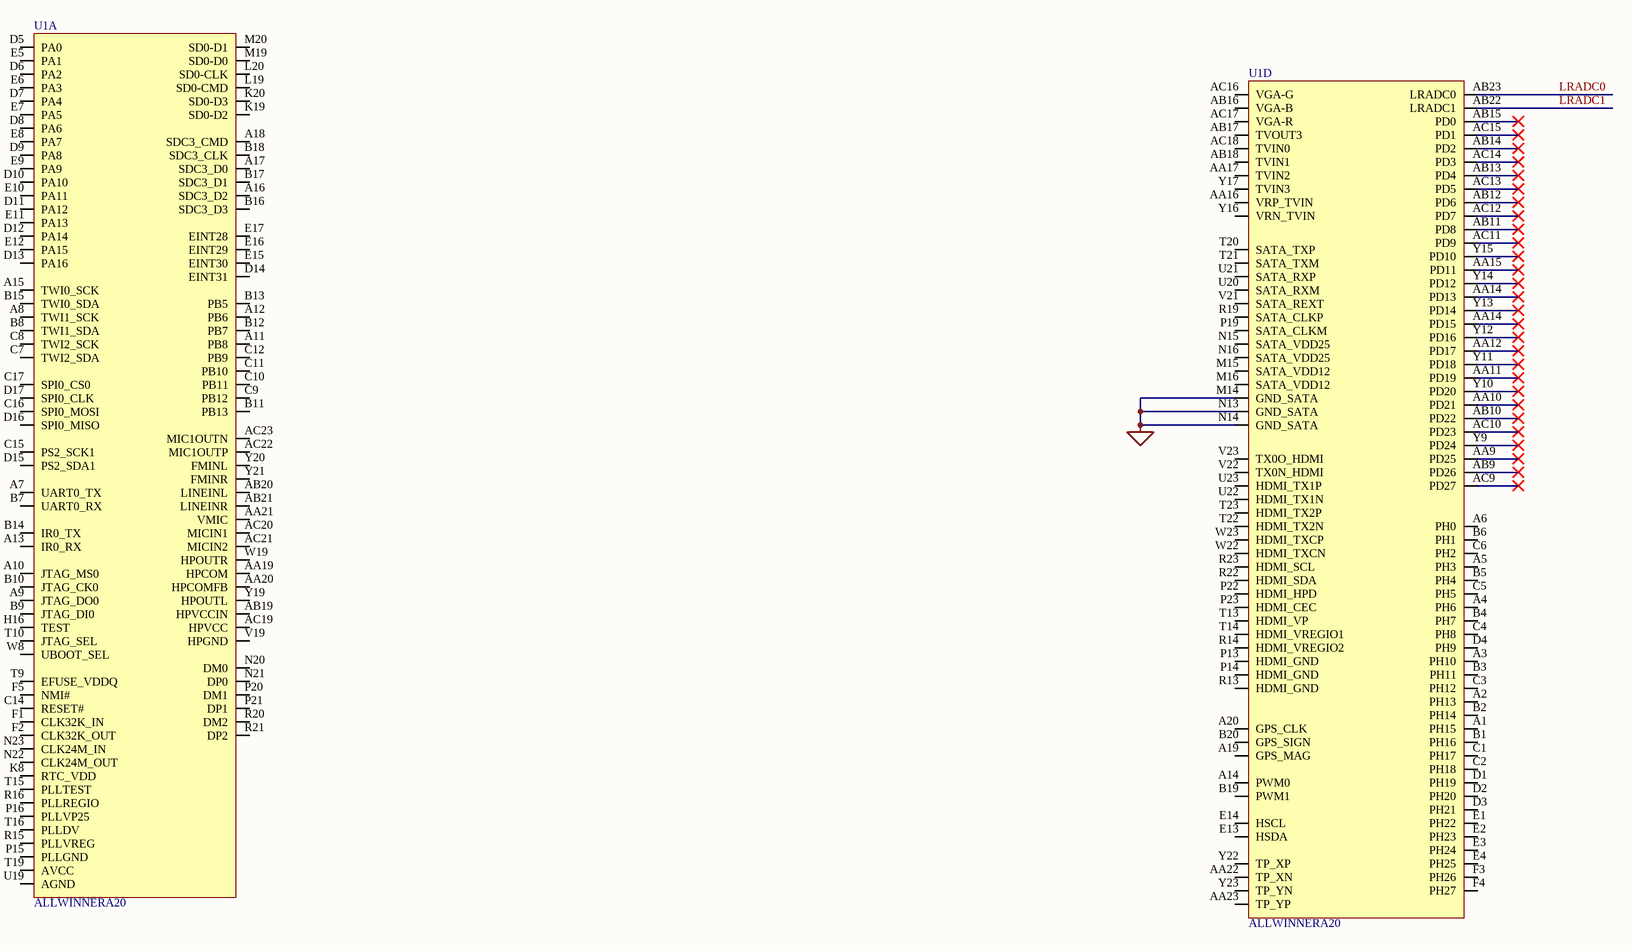
[diagram p7: [07]CPU-Periph.SchDoc]

### Parts
U1  MPN: ALLWINNERA20  [A20]  (hidden comment: Allwinner A20 SOC)  (parts A,D of 5)

### Nets
SGND: U1.M14(GND_SATA) U1.N13(GND_SATA) U1.N14(GND_SATA)
LRADC0: U1.AB23(LRADC0)
LRADC1: U1.AB22(LRADC1)

Not connected (* = marked no-connect by the designer): U1 A1(PH15) A2(PH13) A3(PH10) A4(PH6) A5(PH3) A6(PH0) A7(UART0_TX) A8(TWI1_SCK) A9(JTAG_DO0) A10(JTAG_MS0) A11(PB8) A12(PB6) A13(IR0_RX) A14(PWM0) A15(TWI0_SCK) A16(SDC3_D2) A17(SDC3_D0) A18(SDC3_CMD) A19(GPS_MAG) A20(GPS_CLK) AA9(PD25)* AA10(PD21)* AA11(PD19)* AA12(PD17)* AA14(PD13)* AA15(PD11)* AA16(VRP_TVIN) AA17(TVIN2) AA19(HPCOM) AA20(HPCOMFB) AA21(VMIC) AA22(TP_XN) AA23(TP_YP) AB9(PD26)* AB10(PD22)* AB11(PD8)* AB12(PD6)* AB13(PD4)* AB14(PD2)* AB15(PD0)* AB16(VGA-B) AB17(TVOUT3) AB18(TVIN1) AB19(HPVCCIN) AB20(LINEINL) AB21(LINEINR) AC9(PD27)* AC10(PD23)* AC11(PD9)* AC12(PD7)* AC13(PD5)* AC14(PD3)* AC15(PD1)* AC16(VGA-G) AC17(VGA-R) AC18(TVIN0) AC19(HPVCC) AC20(MICIN1) AC21(MICIN2) AC22(MIC1OUTP) AC23(MIC1OUTN) B1(PH16) B2(PH14) B3(PH11) B4(PH7) B5(PH4) B6(PH1) B7(UART0_RX) B8(TWI1_SDA) B9(JTAG_DI0) B10(JTAG_CK0) B11(PB13) B12(PB7) B13(PB5) B14(IR0_TX) B15(TWI0_SDA) B16(SDC3_D3) B17(SDC3_D1) B18(SDC3_CLK) B19(PWM1) B20(GPS_SIGN) C1(PH17) C2(PH18) C3(PH12) C4(PH8) C5(PH5) C6(PH2) C7(TWI2_SDA) C8(TWI2_SCK) C9(PB12) C10(PB11) C11(PB10) C12(PB9) C14(RESET#) C15(PS2_SCK1) C16(SPI0_MOSI) C17(SPI0_CS0) D1(PH19) D2(PH20) D3(PH21) D4(PH9) D5(PA0) D6(PA2) D7(PA4) D8(PA6) D9(PA8) D10(PA10) D11(PA12) D12(PA14) D13(PA16) D14(EINT31) D15(PS2_SDA1) D16(SPI0_MISO) D17(SPI0_CLK) E1(PH22) E2(PH23) E3(PH24) E4(PH25) E5(PA1) E6(PA3) E7(PA5) E8(PA7) E9(PA9) E10(PA11) E11(PA13) E12(PA15) E13(HSDA) E14(HSCL) E15(EINT30) E16(EINT29) E17(EINT28) F1(CLK32K_IN) F2(CLK32K_OUT) F3(PH26) F4(PH27) F5(NMI#) H16(TEST) K8(RTC_VDD) K19(SD0-D2) K20(SD0-D3) L19(SD0-CMD) L20(SD0-CLK) M15(SATA_VDD12) M16(SATA_VDD12) M19(SD0-D0) M20(SD0-D1) N15(SATA_VDD25) N16(SATA_VDD25) N20(DM0) N21(DP0) N22(CLK24M_OUT) N23(CLK24M_IN) P13(HDMI_GND) P14(HDMI_GND) P15(PLLGND) P16(PLLVP25) P19(SATA_CLKM) P20(DM1) P21(DP1) P22(HDMI_HPD) P23(HDMI_CEC) R13(HDMI_GND) R14(HDMI_VREGIO2) R15(PLLVREG) R16(PLLREGIO) R19(SATA_CLKP) R20(DM2) R21(DP2) R22(HDMI_SDA) R23(HDMI_SCL) T9(EFUSE_VDDQ) T10(JTAG_SEL) T13(HDMI_VP) T14(HDMI_VREGIO1) T15(PLLTEST) T16(PLLDV) T19(AVCC) T20(SATA_TXP) T21(SATA_TXM) T22(HDMI_TX2N) T23(HDMI_TX2P) U19(AGND) U20(SATA_RXM) U21(SATA_RXP) U22(HDMI_TX1N) U23(HDMI_TX1P) V19(HPGND) V21(SATA_REXT) V22(TX0N_HDMI) V23(TX0O_HDMI) W8(UBOOT_SEL) W19(HPOUTR) W22(HDMI_TXCN) W23(HDMI_TXCP) Y9(PD24)* Y10(PD20)* Y11(PD18)* Y12(PD16)* Y13(PD14)* Y14(PD12)* Y15(PD10)* Y16(VRN_TVIN) Y17(TVIN3) Y19(HPOUTL) Y20(FMINL) Y21(FMINR) Y22(TP_XP) Y23(TP_YN)

### Library data of the parts
U1 = ALLWINNER-A20

## Nets that join several sheets
1V5: [02]Power (5 pins), [01]DDR3 (41 pins), [06]CPU-PWR (10 pins)
3V3: [02]Power (10 pins), [03]SDCard (8 pins), [04]USB (R41.1), [05]Ethernet (9 pins), [06]CPU-PWR (20 pins)
DC5V: [02]Power (5 pins), [04]USB (6 pins)
SGND: [02]Power (45 pins), [01]DDR3 (46 pins), [03]SDCard (7 pins), [04]USB (21 pins), [05]Ethernet (21 pins), [06]CPU-PWR (41 pins), [07]CPU-Periph (U1.M14 U1.N13 U1.N14)
VDD25-TVIN: [02]Power (C19#1.2 C?#2.1), [06]CPU-PWR (U1.W17)
VDD_CPU: [02]Power (C34.1 C35.2 L3.2 U6.10), [06]CPU-PWR (6 pins)
VDD_INT: [02]Power (C37.1 C38.2 L4.2 U6.17), [06]CPU-PWR (13 pins)
USB0-DRV: [02]Power (U6.6), [04]USB (R44.1 U8.4)